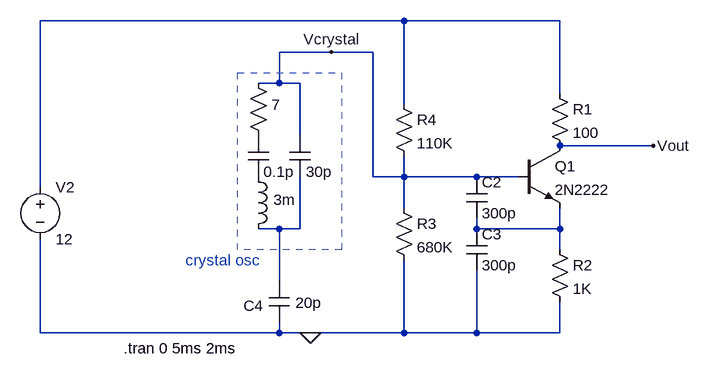
[diagram p0: schematic oscil.asc]
oscil.asc, the LTspice schematic file:
Version 4
SHEET 1 880 680
WIRE 144 -80 -416 -80
WIRE 384 -80 144 -80
WIRE 32 -32 -48 -32
WIRE 96 -32 32 -32
WIRE -48 16 -48 -32
WIRE -48 16 -80 16
WIRE -16 16 -48 16
WIRE 384 32 384 -80
WIRE 144 48 144 -80
WIRE -16 96 -16 16
WIRE 528 112 384 112
WIRE 96 160 96 -32
WIRE 144 160 144 128
WIRE 144 160 96 160
WIRE 256 160 144 160
WIRE 320 160 256 160
WIRE -416 176 -416 -80
WIRE 144 208 144 160
WIRE -48 240 -80 240
WIRE -16 240 -16 160
WIRE -16 240 -48 240
WIRE 256 240 256 224
WIRE 384 240 384 208
WIRE 384 240 256 240
WIRE 384 272 384 240
WIRE -48 320 -48 240
WIRE -416 400 -416 256
WIRE -48 400 -48 384
WIRE -48 400 -416 400
WIRE 0 400 -48 400
WIRE 144 400 144 288
WIRE 144 400 0 400
WIRE 256 400 256 304
WIRE 256 400 144 400
WIRE 384 400 384 352
WIRE 384 400 256 400
FLAG 0 400 0
FLAG 528 112 Vout
FLAG 32 -32 Vcrystal
SYMBOL npn 320 112 R0
SYMATTR InstName Q1
SYMATTR Value 2N2222
SYMBOL res 368 16 R0
SYMATTR InstName R1
SYMATTR Value 100
SYMBOL res 368 256 R0
SYMATTR InstName R2
SYMATTR Value 1K
SYMBOL cap 240 160 R0
SYMATTR InstName C2
SYMATTR Value 300p
SYMBOL cap 240 240 R0
SYMATTR InstName C3
SYMATTR Value 300p
SYMBOL res 128 192 R0
SYMATTR InstName R3
SYMATTR Value 680K
SYMBOL res 128 32 R0
SYMATTR InstName R4
SYMATTR Value 110K
SYMBOL cap -64 320 R0
WINDOW 0 -39 38 Left 2
WINDOW 3 41 34 Left 2
SYMATTR InstName C4
SYMATTR Value 20p
SYMBOL voltage -416 160 R0
WINDOW 123 0 0 Left 0
WINDOW 39 0 0 Left 0
SYMATTR InstName V2
SYMATTR Value 12
SYMBOL res -96 0 R0
WINDOW 0 36 40 Invisible 2
WINDOW 3 36 49 Left 2
SYMATTR InstName R6
SYMATTR Value 7
SYMBOL cap -96 96 R0
WINDOW 0 24 8 Invisible 2
SYMATTR InstName C7
SYMATTR Value 0.1p
SYMBOL ind -96 144 R0
WINDOW 0 36 40 Invisible 2
WINDOW 3 39 51 Left 2
SYMATTR InstName L2
SYMATTR Value 3m
SYMBOL cap -32 96 R0
WINDOW 0 24 8 Invisible 2
WINDOW 3 25 56 Left 2
SYMATTR InstName C8
SYMATTR Value 30p
TEXT -288 424 Left 2 !.tran 0 5ms 2ms
TEXT -192 288 Left 2 ;crystal osc
RECTANGLE Normal 48 272 -112 0 2

The netlist it stands for:
* oscil.asc
Q1 Vout Vcrystal N003 0 2N2222
R1 N001 Vout 100
R2 N003 0 1K
C2 Vcrystal N003 300p
C3 N003 0 300p
R3 Vcrystal 0 680K
R4 N001 Vcrystal 110K
C4 N002 0 20p
V2 N001 0 12
R6 Vcrystal P001 7
C7 P001 P002 0.1p
L2 P002 N002 3m
C8 Vcrystal N002 30p
.model NPN NPN
.model PNP PNP
.lib standard.bjt
.tran 0 5ms 2ms
* crystal osc
.backanno
.end